# EAGLE design sensorfly_boardonly (EAGLE 5.11)

## Sheet 1 of 3
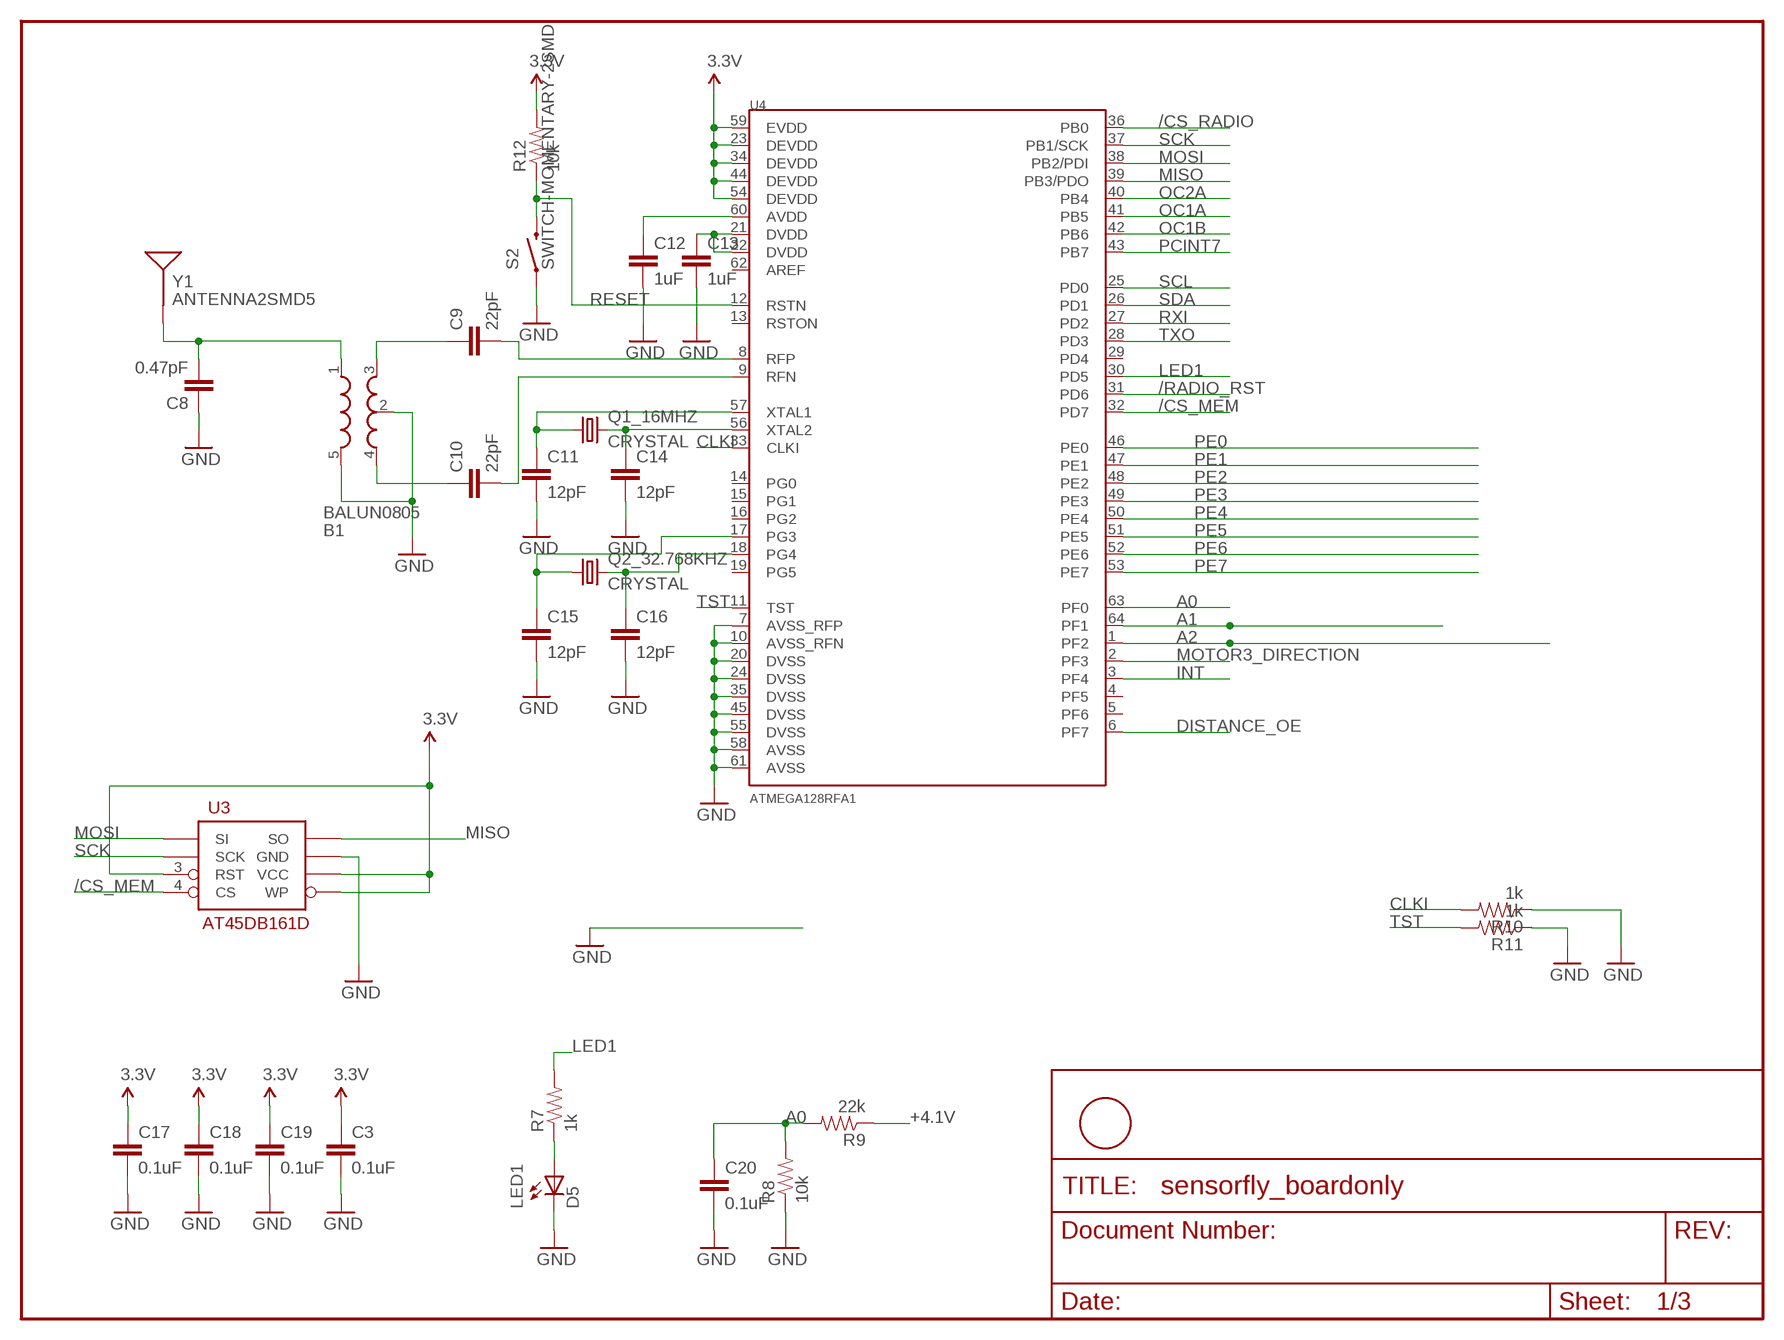
[diagram p0: schematic, sheet 1]

### Parts
B1  BALUN0805  [BALUN]
C3  0.1uF  CAP0402-CAP  [0402-CAP]
C8  0.47pF  CAP0402-CAP  [0402-CAP]
C9  22pF  CAP0402-CAP  [0402-CAP]
C10  22pF  CAP0402-CAP  [0402-CAP]
C11  12pF  CAP0402-CAP  [0402-CAP]
C12  1uF  CAP0805  [0805]
C13  1uF  CAP0805  [0805]
C14  12pF  CAP0402-CAP  [0402-CAP]
C15  12pF  CAP0402-CAP  [0402-CAP]
C16  12pF  CAP0402-CAP  [0402-CAP]
C17  0.1uF  CAP0402-CAP  [0402-CAP]
C18  0.1uF  CAP0402-CAP  [0402-CAP]
C19  0.1uF  CAP0402-CAP  [0402-CAP]
C20  0.1uF  CAP0402-CAP  [0402-CAP]
D5  LED1  LED0603  [LED-0603]
Q1_16MHZ  CRYSTAL  [TC26V]
Q2_32.768KHZ  CRYSTAL  [TC26V]
R7  1k  RESISTOR0402-RES  [0402-RES]
R8  10k  RESISTOR0402-RES  [0402-RES]
R9  22k  RESISTOR0402-RES  [0402-RES]
R10  1k  RESISTOR0402-RES  [0402-RES]
R11  1k  RESISTOR0402-RES  [0402-RES]
R12  10k  RESISTOR0402-RES  [0402-RES]
S2  SWITCH-MOMENTARY-2SMD  [TACTILE_SWITCH_SMD]
U3  AT45DB161D  [SO08-EIAJ]
U4  ATMEGA128RFA1  [QFN-64]
U$1  SENSORFLUSMALLER  [SENSORFLY_SMALLER]
Y1  ANTENNA2SMD5  [ANTENNA-CHIP5]

### Nets
3.3V: C3.1 C17.1 C18.1 C19.1 R12.2 U3.3(RST) U3.5(WP) U3.6(VCC) U4.23(DEVDD) U4.34(DEVDD) U4.44(DEVDD) U4.54(DEVDD) U4.59(EVDD) ; also sheet 2,3
+4.1V: R9.1 ; also sheet 2,3
/CS_MEM: U3.4(CS) U4.32(PD7)
/CS_RADIO: U4.36(PB0) ; also sheet 2
/RADIO_RST: U4.31(PD6) ; also sheet 2
A0: C20.1 R8.2 R9.2 U4.63(PF0) ; also sheet 2
A1: U4.64(PF1) ; also sheet 2
A2: U4.1(PF2) ; also sheet 2
CLKI: R10.2 U4.33(CLKI)
DISTANCE_OE: U4.6(PF7) ; also sheet 2
GND: B1.2(GND) B1.5(GND) C3.2 C8.1 C11.2 C12.2 C13.2 C14.2 C15.2 C16.2 C17.2 C18.2 C19.2 C20.2 D5.C R8.1 R10.1 R11.1 S2.1 U3.7(GND) U4.7(AVSS_RFP) U4.10(AVSS_RFN) U4.20(DVSS) U4.24(DVSS) U4.35(DVSS) U4.45(DVSS) U4.55(DVSS) U4.58(AVSS) U4.61(AVSS) ; also sheet 2,3
INT: U4.3(PF4) ; also sheet 2
LED1: R7.2 U4.30(PD5)
MISO: U3.8(SO) U4.39(PB3/PDO) ; also sheet 2
MOSI: U3.1(SI) U4.38(PB2/PDI) ; also sheet 2
MOTOR3_DIRECTION: U4.2(PF3) ; also sheet 3
N$66: B1.3(OUT1) C9.1
N$68: B1.4(OUT2) C10.1
N$70: B1.1(IN) C8.2 Y1.FEED(SIGNAL)
N$71: C10.2 U4.9(RFN)
N$72: C9.2 U4.8(RFP)
N$75: C12.1 U4.60(AVDD)
N$76: C11.1 Q1_16MHZ.1 U4.57(XTAL1)
N$77: C14.1 Q1_16MHZ.2 U4.56(XTAL2)
N$78: C15.1 Q2_32.768KHZ.1 U4.17(PG3)
N$79: C16.1 Q2_32.768KHZ.2 U4.18(PG4)
N$98: C13.1 U4.21(DVDD) U4.22(DVDD)
N$99: D5.A R7.1
OC1A: U4.41(PB5) ; also sheet 3
OC1B: U4.42(PB6) ; also sheet 3
OC2A: U4.40(PB4) ; also sheet 3
PCINT7: U4.43(PB7) ; also sheet 2
PE0: U4.46(PE0) ; also sheet 2
PE1: U4.47(PE1) ; also sheet 2
PE2: U4.48(PE2) ; also sheet 2
PE3: U4.49(PE3) ; also sheet 2
PE4: U4.50(PE4) ; also sheet 2
PE5: U4.51(PE5) ; also sheet 2
PE6: U4.52(PE6) ; also sheet 2
PE7: U4.53(PE7) ; also sheet 2
RESET: R12.1 S2.3 U4.12(RSTN) ; also sheet 2
RXI: U4.27(PD2) ; also sheet 2
SCK: U3.2(SCK) U4.37(PB1/SCK) ; also sheet 2
SCL: U4.25(PD0) ; also sheet 2
SDA: U4.26(PD1) ; also sheet 2
TST: R11.2 U4.11(TST)
TXO: U4.28(PD3) ; also sheet 2
Unconnected: U4.4(PF5) U4.5(PF6) U4.13(RSTON) U4.14(PG0) U4.15(PG1) U4.16(PG2) U4.19(PG5) U4.29(PD4) U4.62(AREF)

## Sheet 2 of 3
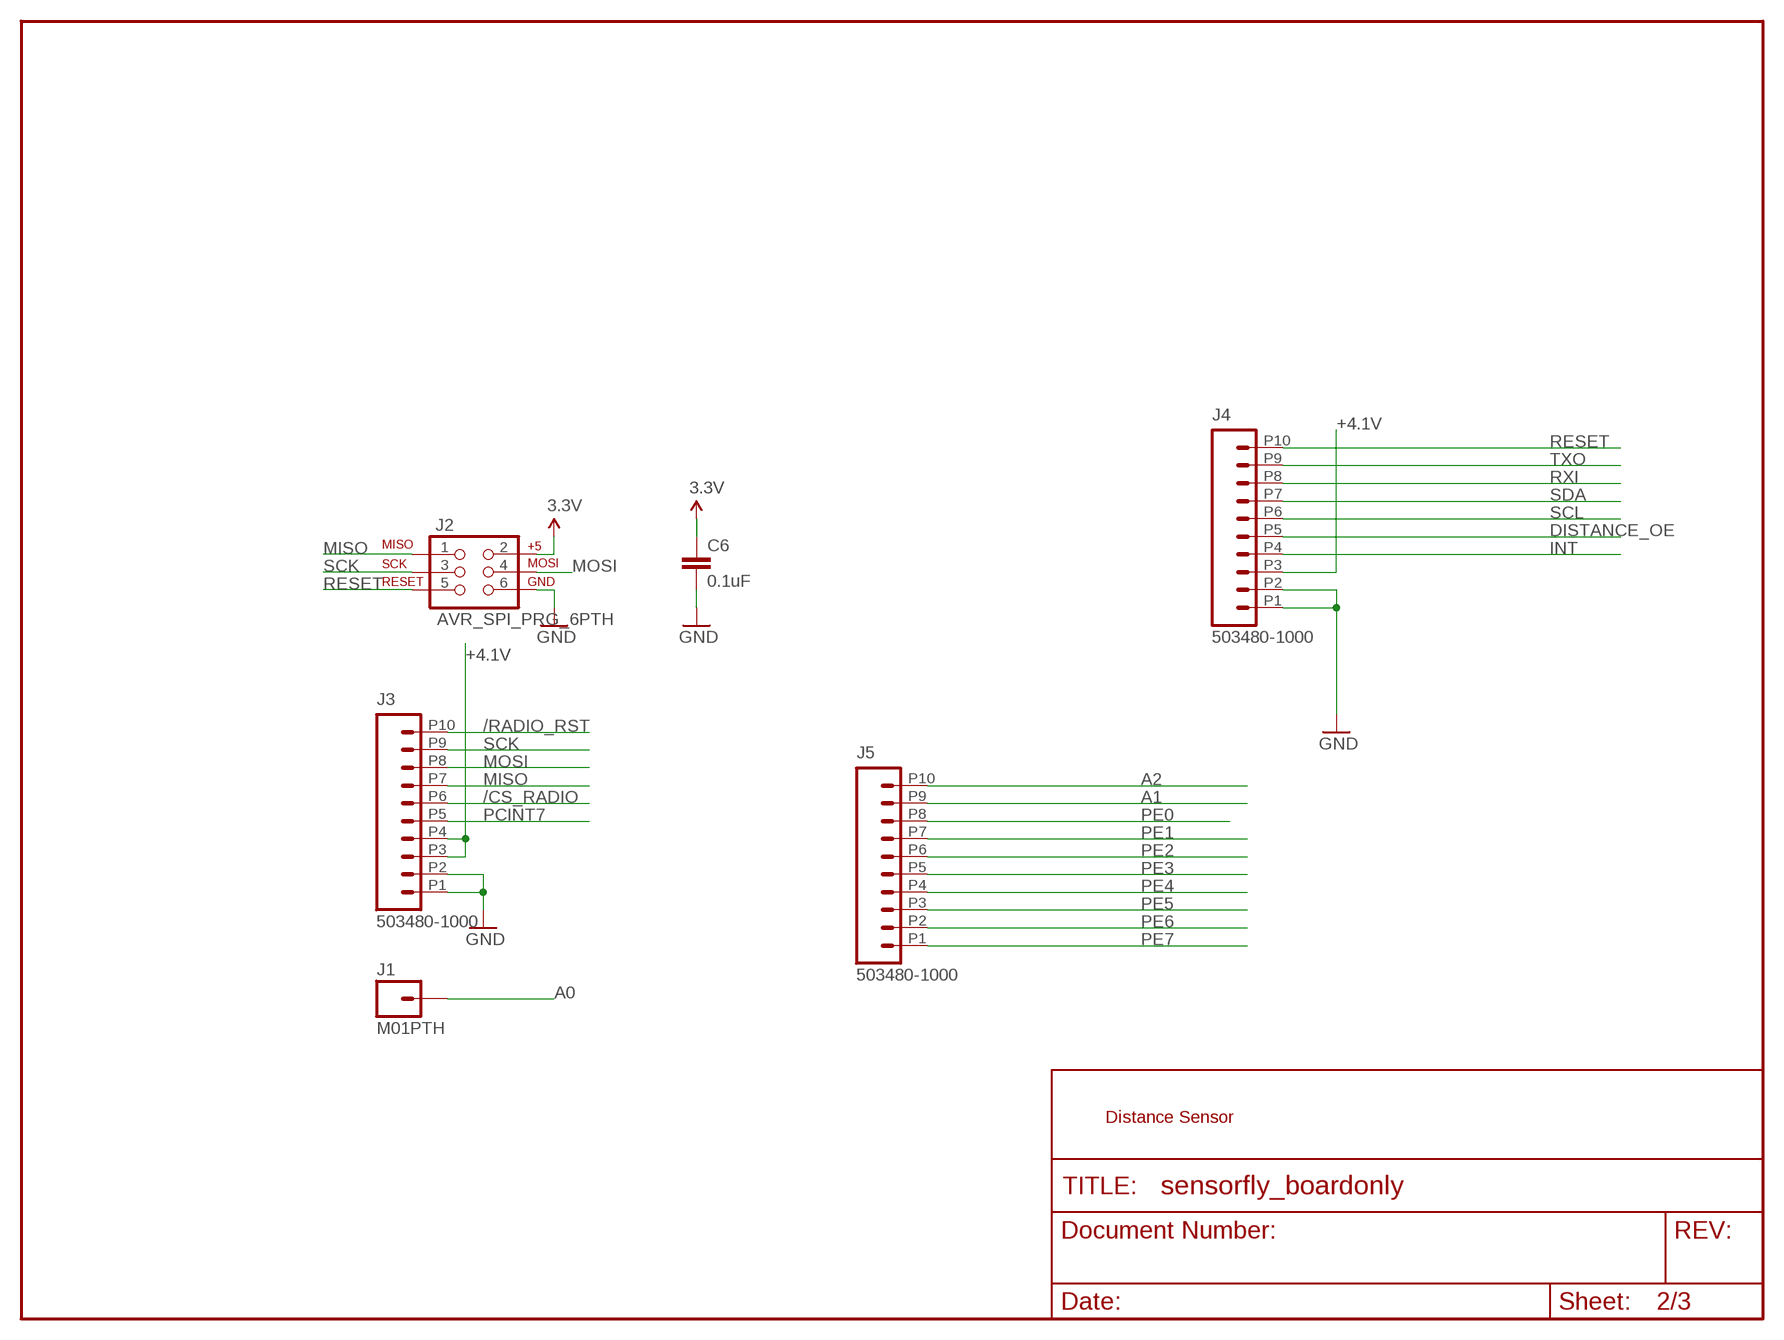
[diagram p1: schematic, sheet 2]

### Parts
C6  0.1uF  CAP0402-CAP  [0402-CAP]
J1  M01PTH  [1X01]
J2  AVR_SPI_PRG_6PTH  [2X3]
J3  503480-1000  [503480-1000]
J4  503480-1000  [503480-1000]
J5  503480-1000  [503480-1000]

### Nets
3.3V: C6.1 J2.2 ; also sheet 1,3
+4.1V: J3.P3 J3.P4 J4.P3 ; also sheet 1,3
/CS_RADIO: J3.P6 ; also sheet 1
/RADIO_RST: J3.P10 ; also sheet 1
A0: J1.1 ; also sheet 1
A1: J5.P9 ; also sheet 1
A2: J5.P10 ; also sheet 1
DISTANCE_OE: J4.P5 ; also sheet 1
GND: C6.2 J2.6 J3.P1 J3.P2 J4.P1 J4.P2 ; also sheet 1,3
INT: J4.P4 ; also sheet 1
MISO: J2.1 J3.P7 ; also sheet 1
MOSI: J2.4 J3.P8 ; also sheet 1
PCINT7: J3.P5 ; also sheet 1
PE0: J5.P8 ; also sheet 1
PE1: J5.P7 ; also sheet 1
PE2: J5.P6 ; also sheet 1
PE3: J5.P5 ; also sheet 1
PE4: J5.P4 ; also sheet 1
PE5: J5.P3 ; also sheet 1
PE6: J5.P2 ; also sheet 1
PE7: J5.P1 ; also sheet 1
RESET: J2.5 J4.P10 ; also sheet 1
RXI: J4.P8 ; also sheet 1
SCK: J2.3 J3.P9 ; also sheet 1
SCL: J4.P6 ; also sheet 1
SDA: J4.P7 ; also sheet 1
TXO: J4.P9 ; also sheet 1

### Notes on the sheet
- Distance Sensor

## Sheet 3 of 3
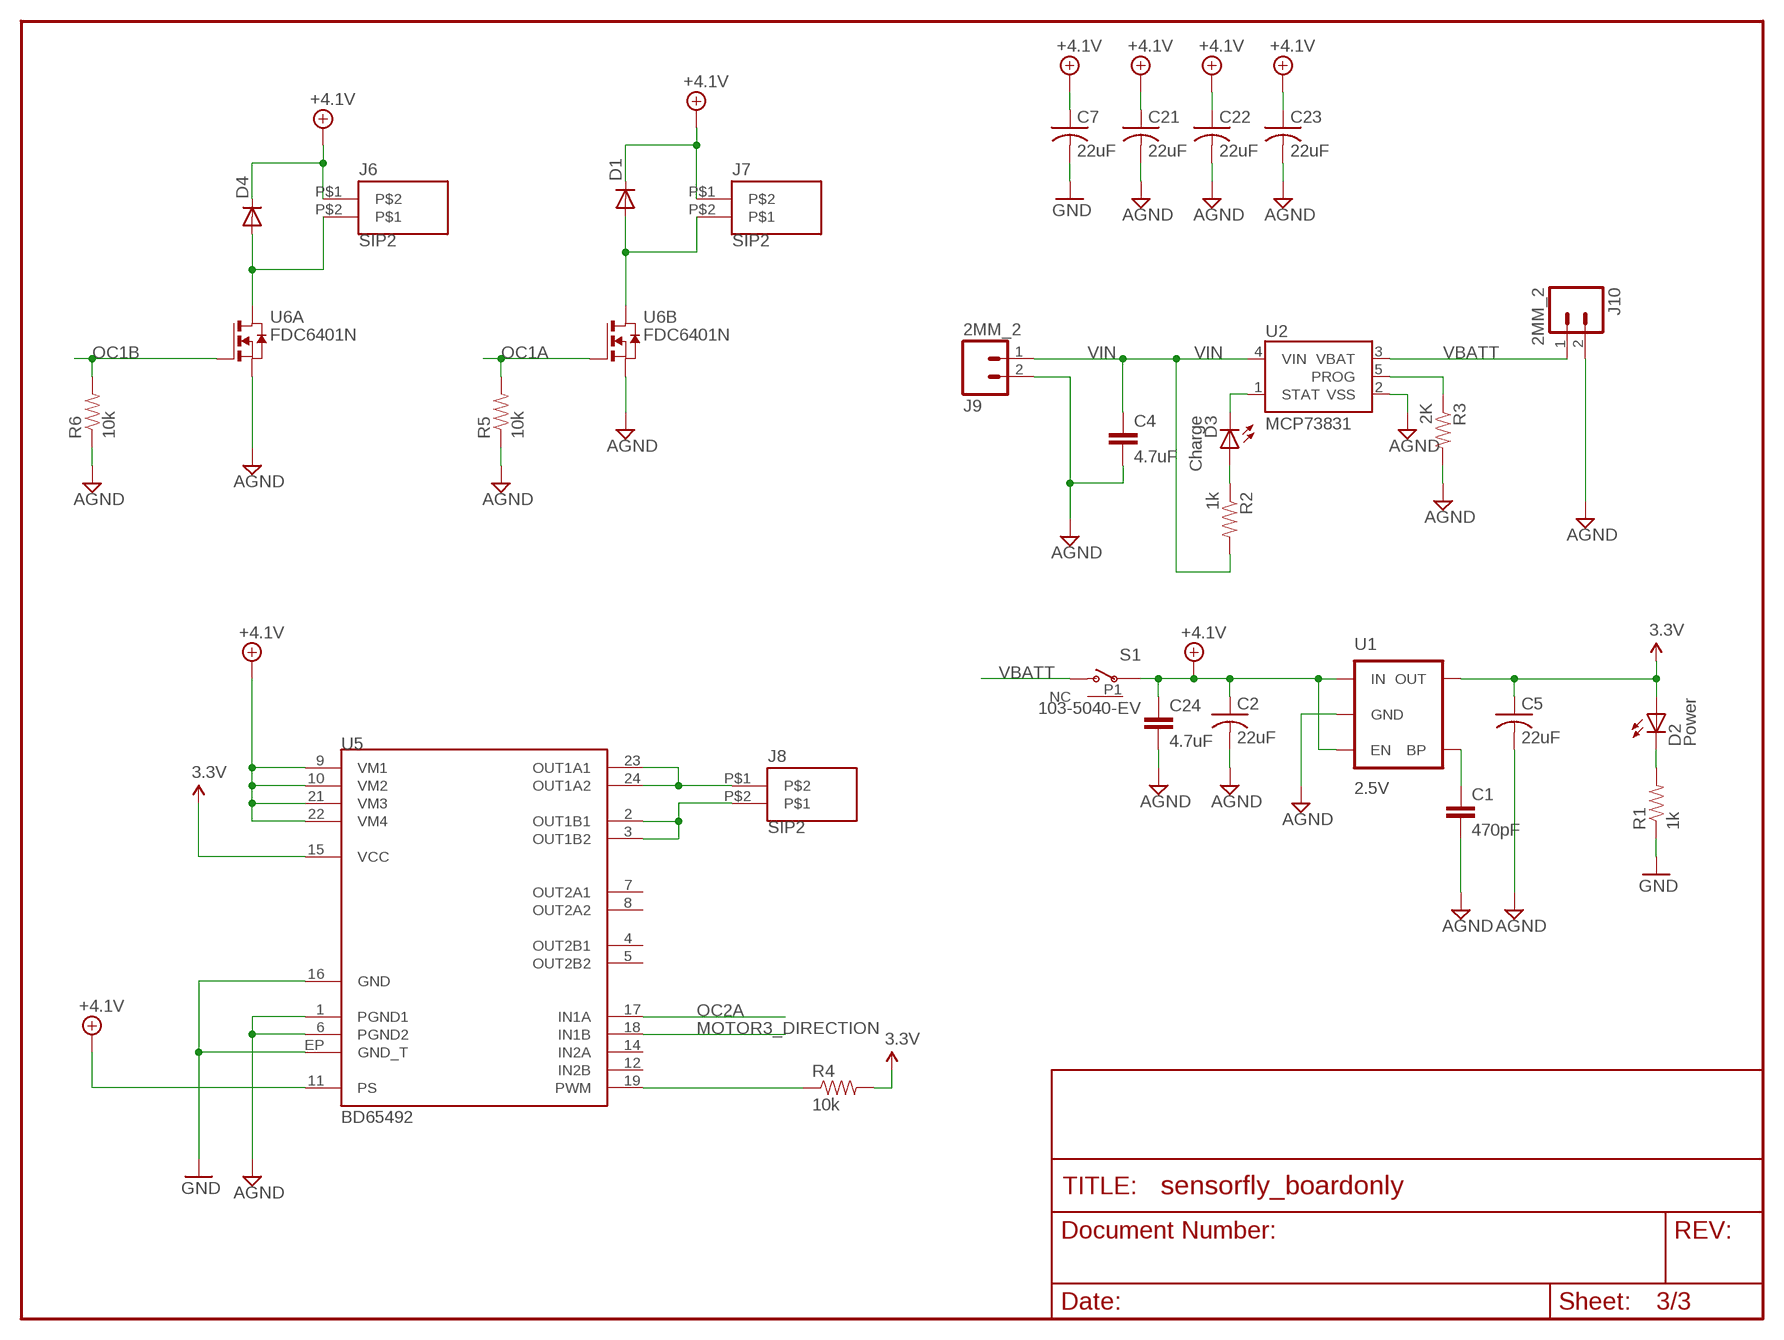
[diagram p2: schematic, sheet 3]

### Parts
C1  470pF  CAP0402-CAP  [0402-CAP]
C2  22uF  C-USC0805  [C0805]
C4  4.7uF  CAP0805  [0805]
C5  22uF  C-USC0805  [C0805]
C7  22uF  C-USC0805  [C0805]
C21  22uF  C-USC0805  [C0805]
C22  22uF  C-USC0805  [C0805]
C23  22uF  C-USC0805  [C0805]
C24  4.7uF  CAP0805  [0805]
D1  DIODESOD  [SOD-323]
D2  Power  LED0603  [LED-0603]
D3  Charge  LED0603  [LED-0603]
D4  DIODESOD  [SOD-323]
J6  SIP2  [SIP2.05]
J7  SIP2  [SIP2.05]
J8  SIP2  [SIP2.05]
J9  2MM_2  [PH02]
J10  2MM_2  [PH02]
R1  1k  RESISTOR0402-RES  [0402-RES]
R2  1k  RESISTOR0402-RES  [0402-RES]
R3  2K  RESISTOR0402-RES  [0402-RES]
R4  10k  RESISTOR0402-RES  [0402-RES]
R5  10k  RESISTOR0402-RES  [0402-RES]
R6  10k  RESISTOR0402-RES  [0402-RES]
S1  103-5040-EV  [103-5040-EV]
U1  2.5V  V_REG_LDOSMD  [SOT23-5]
U2  MCP73831  [SOT23-5]
U5  BD65492  [QFN-24]
U6  FDC6401N  [SUPERSOT-6]

### Nets
3.3V: C5.1 D2.A R4.2 U1.5(OUT) U5.15(VCC) ; also sheet 1,2
+4.1V: C2.1 C7.1 C21.1 C22.1 C23.1 C24.1 D1.1(C) D4.1(C) J6.P$1 J7.P$1 S1.P3(P) U1.1(IN) U1.3(EN) U5.9(VM1) U5.10(VM2) U5.11(PS) U5.21(VM3) U5.22(VM4) ; also sheet 1,2
AGND: C1.2 C2.2 C4.2 C5.2 C21.2 C22.2 C23.2 C24.2 J9.2 J10.2 R3.2 R5.1 R6.1 U1.2(GND) U2.2(VSS) U5.1(PGND1) U5.6(PGND2) U6.P$2(B:S) U6.P$5(A:S)
GND: C7.2 R1.1 U5.16(GND) U5.EP(GND_T) ; also sheet 1,2
MOTOR3_DIRECTION: U5.18(IN1B) ; also sheet 1
N$1: D2.C R1.2
N$2: C1.1 U1.4(BP)
N$3: D3.A R2.1
N$67: D1.2(A) J7.P$2 U6.P$4(B:D)
N$69: D4.2(A) J6.P$2 U6.P$6(A:D)
N$114: J8.P$1 U5.23(OUT1A1) U5.24(OUT1A2)
N$115: J8.P$2 U5.2(OUT1B1) U5.3(OUT1B2)
N$120: R4.1 U5.19(PWM)
OC1A: R5.2 U6.P$3(B:G) ; also sheet 1
OC1B: R6.2 U6.P$1(A:G) ; also sheet 1
OC2A: U5.17(IN1A) ; also sheet 1
PROG1: R3.1 U2.5(PROG)
STAT1: D3.C U2.1(STAT)
VBATT: J10.1 S1.P2(O) U2.3(VBAT)
VIN: C4.1 J9.1 R2.2 U2.4(VIN)
Unconnected: S1.P1(NC) U5.4(OUT2B1) U5.5(OUT2B2) U5.7(OUT2A1) U5.8(OUT2A2) U5.12(IN2B) U5.14(IN2A)

## Library data of the parts
B1 = SparkFun:BALUN
C1 C3 C4 C6 C8-C20 C24 = SparkFun:CAP: Capacitor Standard 0603 ceramic capacitor, and 0.1" leaded capacitor.
C2 C5 C7 C21-C23 = rcl:C-US: CAPACITOR, American symbol
D1 D4 = SparkFun:DIODE: Diode These are standard reverse protection diodes and small signal diodes. SMA package can handle up to about 1A. SOD-323 can handle about 200mA. What the SOD-323 package when ordering, there are some mfgs out there that are 5-pin packages.
D2 D3 D5 = SparkFun:LED: LEDs Standard schematic elements and footprints for 5mm, 3mm, 1206, and 0603 sized LEDs. 5mm - Spark Fun Electronics SKU : COM-00529 (and others)
J1 = SparkFun:M01: Header 1 Standard 1-pin 0.1" header. Use with straight break away headers (SKU : PRT-00116), right angle break away headers (PRT-00553), swiss pins (PRT-00743), machine pins (PRT-00117), and female headers (PRT-00115).
J2 = SparkFun:AVR_SPI_PRG_6: AVR ISP 6 Pin This is the reduced ISP connector for AVR programming. Common on Arduino. This footprint will take up less PCB space and can be used with a 10-pin to 6-pin adapter such as SKU: BOB-08508
J3-J5 = pei:503480-1000
J6-J8 = my:SIP2
J9 J10 = SparkFun:2MM_2
Q1_16MHZ Q2_32.768KHZ = pei:CRYSTAL
R1-R12 = SparkFun:RESISTOR: Resistor Basic schematic elements and footprints for 0603, 1206, and PTH resistors.
S1 = pei:103-5040-EV
S2 = SparkFun:SWITCH-MOMENTARY-2
U1 = SparkFun:V_REG_LDO: Voltage Regulator LDO Standard 150mA LDO voltage regulator in SOT-23 layout. Micrel part MIC5205. BP (by-pass) pin is used to lower output noise with 470pF cap.
U2 = SparkFun:MCP73831: Microchip's MCP73831 Miniature single cell, fully integrated Li-Ion, Li-polymer charge management controller http://ww1.microchip.com/downloads/en/DeviceDoc/21984a.pdf
U3 = SparkFun:AT45DB161D
U4 = SparkFun:ATMEGA128RFA1
U5 = pei:BD65492
U6 = pei:FDC6401N
U$1 = my:SENSORFLU
Y1 = SparkFun:ANTENNA2: Antenna Single endded antenna. Common with smaller chip antennas. CHIP4 package is the GPS Chip Antenna SKU: GPS-08418. CHIP5 package is 2.4GHz chip antenna SKU: WRL-00144.

## Net classes
0 default: width 0.152 mm, drill 0.152 mm, clearance 0.152 mm
1 power: width 0.254 mm, drill 0.305 mm, clearance 0.152 mm

## Board
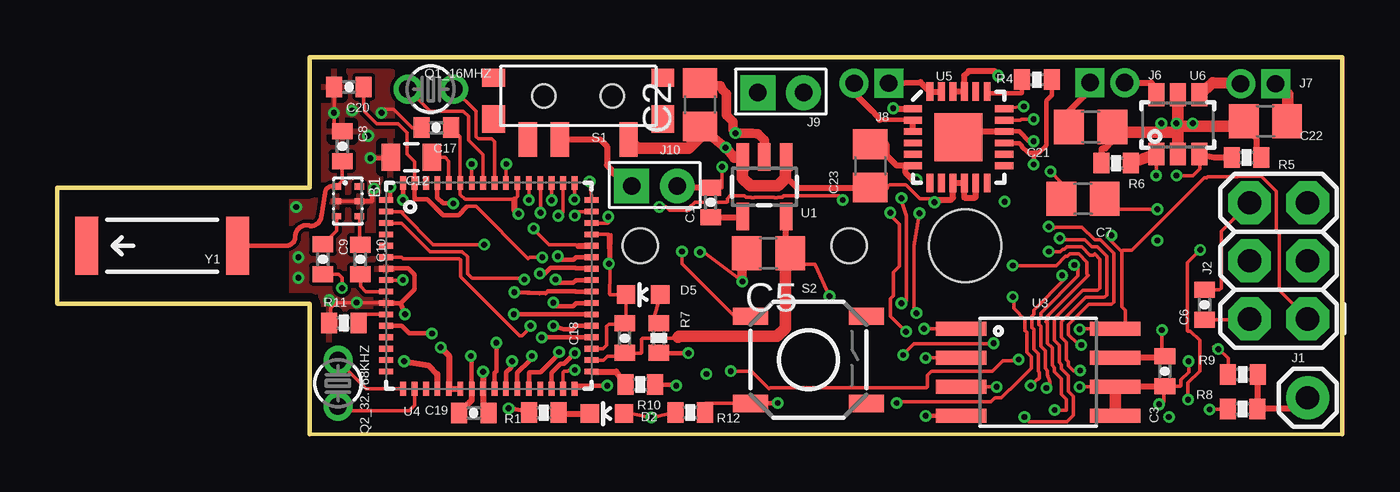
[diagram p3: board, top side]
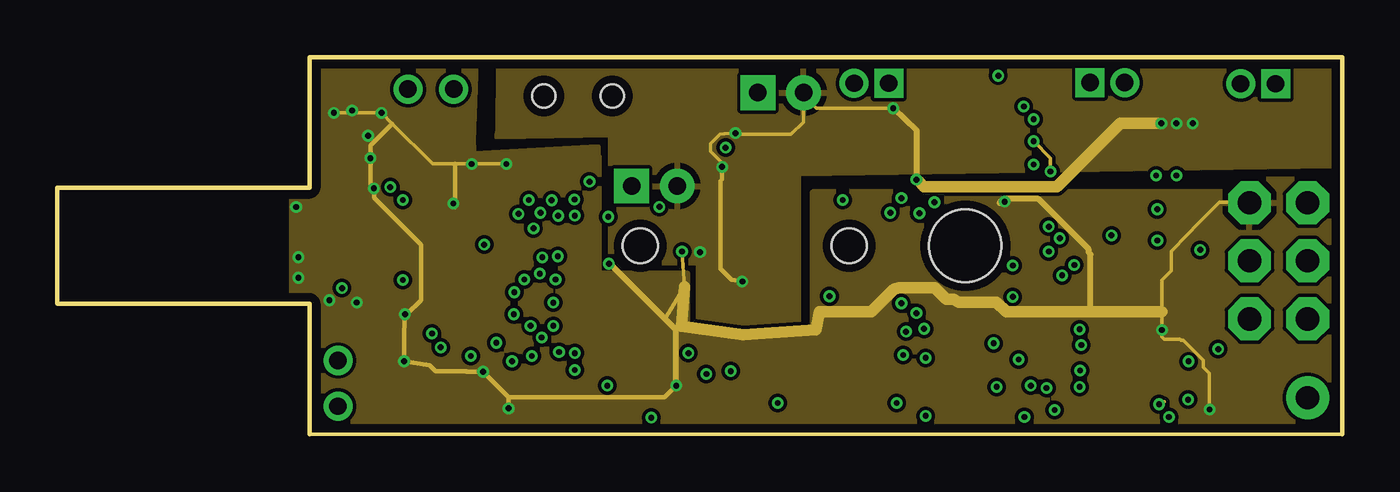
[diagram p4: board, inner layer Route2]
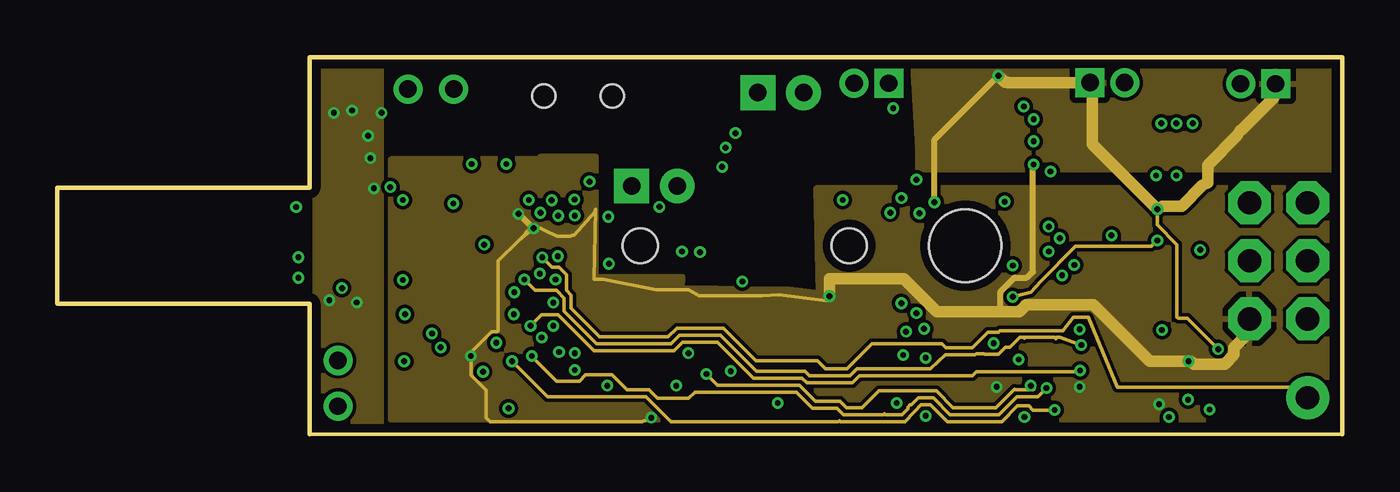
[diagram p5: board, inner layer Route15]
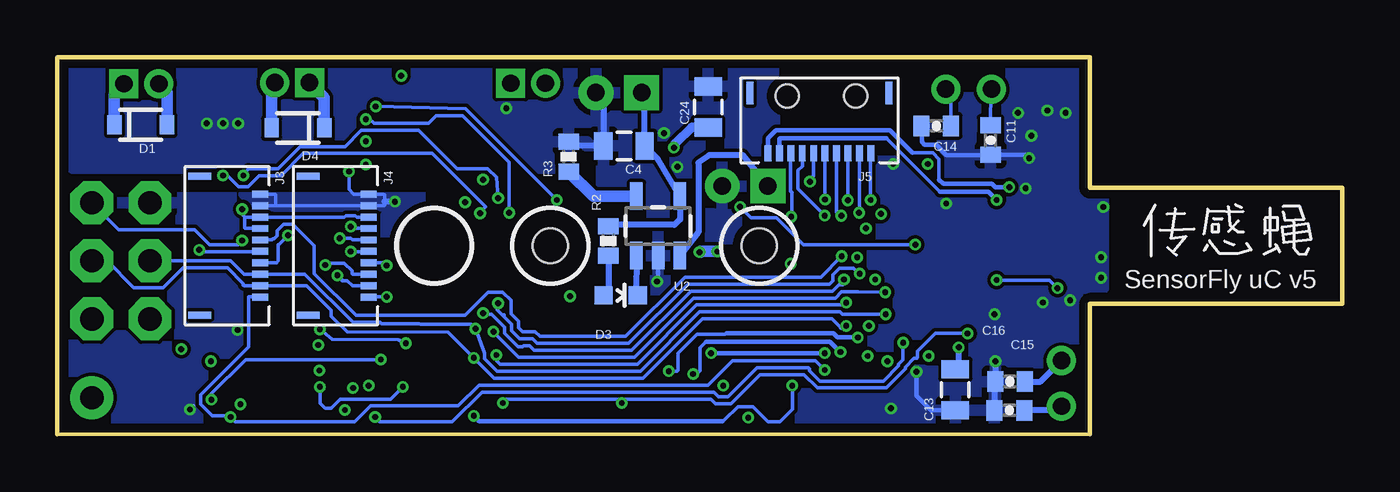
[diagram p6: board, bottom side, seen from below]

Size 56.26 x 16.51 mm. Coordinates in mm from the lower left corner, seen from the top.
Outline: 11.05,16.51 11.05,10.8 0,10.8 0,5.71 11.05,5.71 11.05,0 56.26,0 56.26,16.51 11.05,16.51
Copper layers (1*2+15*16): Top 0.0356mm / dielectric 1.5011mm / Route2 0.0356mm / dielectric 0.1499mm / Route15 0.0356mm / dielectric 0.2007mm / Bottom 0.0356mm
Design rules "typical_4pcb *": minimum track width 5mil, minimum drill 6mil, track to track 6mil, track to pad 6mil, pad to pad 7mil, via to via 7mil, smd to smd 6mil, copper to edge 15mil, drill to drill 8mil, minimum pad ring 10mil, minimum via ring 5mil, stop-mask expansion 4mil, vias tented up to drill 10mil, thermal gap 10mil
Holes 1.52 mm at 25.53,8.25 34.67,8.25
Holes 3.17 mm at 39.75,8.25

### Footprints (pad centres in the part's own frame; a part is rotated, then mirrored left to right if it is on the bottom)
BALUN = smd 0.27 x 0.4: 1 -0.7,-0.5; 2 -0.05,-0.5; 3 0.6,-0.5; 4 0.6,0.5; 5 -0.05,0.5; 6 -0.7,0.5
0402-CAP = smd 0.7 x 0.9: 1 -0.65,0; 2 0.65,0
C0805 = smd 1.3 x 1.5: 1 -0.95,0; 2 0.95,0
0805 = smd 0.8 x 1.2: 1 -0.9,0; 2 0.9,0
SOD-323 = smd 0.63 x 0.83: 1 -1.15,0; 2 1.15,0
LED-0603 = smd 0.8 x 0.8: A 0,-0.75; C 0,0.75
1X01 = drill 1.016 pad 1.88 round: 1 0,0
2X3 = drill 1.016 pad 1.88 octagon: 1 0,0; 2 0,2.54; 3 2.54,0; 4 2.54,2.54; 5 5.08,0; 6 5.08,2.54
503480-1000 = smd 0.3 x 0.7: P1 -2,0; P2 -1.5,0; P3 -1,0; P4 -0.5,0; P5 0,0; P6 0.5,0; P7 1,0; P8 1.5,0; P9 2,0; P10 2.5,0 | smd 0.3 x 1: P$11 -2.79,-2.65; P$12 3.29,-2.65
SIP2.05 = drill 0.762 pad 1.016 square: P$1 0,0 | drill 0.762 pad 1.016 round: P$2 1.524,0
PH02 = drill 0.762 pad 1.524 square: 1 -1,2 | drill 0.762 pad 1.524 round: 2 1,2
TC26V = drill 0.762 pad 1.118 round: 1 -1,0; 2 1,0
0402-RES = smd 0.7 x 0.9: 1 -0.65,0; 2 0.65,0
103-5040-EV = smd 1 x 1.2: CASE1 -3.7,1; CASE5 3.7,1 | smd 1 x 0.8: CASE2 -3.7,-0.8; CASE6 3.7,-0.8 | smd 0.8 x 1.5: P1 2.2,1.9; P2 0.8,1.9; P3 -2.2,1.9 | hole 1.016: -1.5,0; 1.5,0
TACTILE_SWITCH_SMD = smd 1.524 x 0.762: 1 -2.54,1.905; 2 2.54,1.905; 3 -2.54,-1.905; 4 2.54,-1.905
SOT23-5 = smd 0.55 x 1.2: 1 -0.95,-1.3; 2 0,-1.3; 3 0.95,-1.3; 4 0.95,1.3; 5 -0.95,1.3
SO08-EIAJ = smd 0.61 x 2.21: 1 -1.905,-3.378; 2 -0.635,-3.378; 3 0.635,-3.378; 4 1.905,-3.378; 5 1.905,3.353; 6 0.635,3.353; 7 -0.635,3.353; 8 -1.905,3.353
QFN-64 = smd 0.6 x 0.25: 1 -4.5,3.75; 2 -4.5,3.25; 3 -4.5,2.75; 4 -4.5,2.25; 5 -4.5,1.75; 6 -4.5,1.25; 7 -4.5,0.75; 8 -4.5,0.25; 9 -4.5,-0.25; 10 -4.5,-0.75; 11 -4.5,-1.25; 12 -4.5,-1.75; 13 -4.5,-2.25; 14 -4.5,-2.75; 15 -4.5,-3.25; 16 -4.5,-3.75; 33 4.5,-3.75; 34 4.5,-3.25; 35 4.5,-2.75; 36 4.5,-2.25; 37 4.5,-1.75; 38 4.5,-1.25; 39 4.5,-0.75; 40 4.5,-0.25; 41 4.5,0.25; 42 4.5,0.75; 43 4.5,1.25; 44 4.5,1.75; 45 4.5,2.25; 46 4.5,2.75; 47 4.5,3.25; 48 4.5,3.75 | smd 0.25 x 0.6: 17 -3.75,-4.5; 18 -3.25,-4.5; 19 -2.75,-4.5; 20 -2.25,-4.5; 21 -1.75,-4.5; 22 -1.25,-4.5; 23 -0.75,-4.5; 24 -0.25,-4.5; 25 0.25,-4.5; 26 0.75,-4.5; 27 1.25,-4.5; 28 1.75,-4.5; 29 2.25,-4.5; 30 2.75,-4.5; 31 3.25,-4.5; 32 3.75,-4.5; 49 3.75,4.5; 50 3.25,4.5; 51 2.75,4.5; 52 2.25,4.5; 53 1.75,4.5; 54 1.25,4.5; 55 0.75,4.5; 56 0.25,4.5; 57 -0.25,4.5; 58 -0.75,4.5; 59 -1.25,4.5; 60 -1.75,4.5; 61 -2.25,4.5; 62 -2.75,4.5; 63 -3.25,4.5; 64 -3.75,4.5
QFN-24 = smd 0.8 x 0.3: 1 -1.986,1.248; 2 -1.986,0.748; 3 -1.986,0.248; 4 -1.986,-0.252; 5 -1.986,-0.752; 6 -1.986,-1.252; 13 2.014,-1.252; 14 2.014,-0.752; 15 2.014,-0.252; 16 2.014,0.248; 17 2.014,0.748; 18 2.014,1.248 | smd 0.3 x 0.8: 7 -1.236,-2.002; 8 -0.736,-2.002; 9 -0.236,-2.002; 10 0.264,-2.002; 11 0.764,-2.002; 12 1.264,-2.002; 19 1.264,1.998; 20 0.764,1.998; 21 0.264,1.998; 22 -0.236,1.998; 23 -0.736,1.998; 24 -1.236,1.998 | smd 2.1 x 2.1: EP 0,0
SUPERSOT-6 = smd 0.7 x 1: P$1 -0.95,0; P$2 0,0; P$3 0.95,0; P$4 0.95,2.6; P$5 0,2.6; P$6 -0.95,2.6
ANTENNA-CHIP5 = smd 1.016 x 2.54: FEED -3.302,0; NC 3.302,0

### Placement (x,y rotation side)
B1  12.73,10.15 270 top
C1  28.6,10.15 90 top
C2  28.14,14.43 90 top
C3  48.49,2.77 90 top
C4  31.45,12.63 180 bottom
C5  31.14,7.92 180 top
C6  50.23,5.68 90 top
C7  44.91,10.31 180 top
C8  12.48,12.61 270 top
C9  11.63,7.67 270 top
C10  13.28,7.66 270 top
C11  15.4,12.88 270 bottom
C12  15.51,12.13 180 top
C13  16.94,1.96 270 bottom
C14  17.78,13.5 180 bottom
C15  14.55,2.31 180 bottom
C16  14.58,1.06 180 bottom
C17  16.6,13.42 180 top
C18  24.84,4.22 90 top
C19  18.24,0.94 0 top
C20  12.78,15.21 180 top
C21  45.24,13.45 0 top
C22  52.89,13.71 180 top
C23  35.59,11.75 90 top
C24  27.76,14.33 90 bottom
D1  52.6,13.55 0 bottom
D2  24.06,0.91 90 top
D3  31.59,6.09 270 bottom
D4  45.72,13.41 180 bottom
D5  25.65,6.12 90 top
J1  54.74,1.6 0 top
J2  54.74,5.05 90 top
J3  47.37,8.51 270 bottom
J4  42.62,8.51 270 bottom
J5  22.64,12.29 180 bottom
J6  45.21,15.39 0 top
J7  53.34,15.35 180 top
J8  36.41,15.37 180 top
J9  31.68,12.95 0 top
J10  26.15,8.87 0 top
Q1_16MHZ  16.36,15.11 0 top
Q2_32.768KHZ  12.29,2.24 270 top
R1  21.31,0.95 0 top
R2  32.13,8.47 90 bottom
R3  33.87,12.15 90 bottom
R4  42.89,15.52 0 top
R5  52.06,12.12 180 top
R6  46.36,11.87 0 top
R7  26.34,4.22 270 top
R8  51.89,1.11 0 top
R9  51.9,2.62 0 top
R10  25.53,2.18 180 top
R11  12.55,4.88 0 top
R12  27.71,0.95 180 top
S1  22.81,14.81 180 top
S2  32.89,3.27 0 top
U1  30.96,10.84 180 top
U2  29.95,9.13 0 bottom
U3  42.96,2.73 270 top
U4  18.9,6.5 0 top
U5  39.45,13 0 top
U6  49.06,12.27 0 top
U$1  4.93,8.99 0 bottom
Y1  4.6,8.25 180 top

### Tracks (layer width: path | path; a pad name or v marks a point on that pad's centre or on a via)
3.3V  (via drill 0.25 pad 0.51)
  Top 0.152: C17.1 17.65,13.03 U4.59 17.65,10.5 17.86,10.29 20.01,10.29 20.15,10.42 U4.54 | U4.34 23.93,3.25 24.1,3.43 24.7,3.43 C18.1 24.89,3.56 25.55,3.56 25.58,3.58 25.58,4.17 25.63,4.22 27.05,4.22 27.08,4.24 27.18,4.24 | R12.2 27.05,0.96 v26.01,0.74 24.87,0.96 D2.A | 32.11,7.44 33.17,7.44 v33.81,6.05 | U3.3 39.6,2.08 v41.12,2.08 | U3.6 46.08,2.08 v44.76,2.08 | v20.85,9.02 20.9,8.94 21.54,8.31 22.71,8.31 22.81,8.25 | v48.23,1.32 48.34,1.32 48.44,1.42 48.44,1.98 C3.1 48.59,2.11 49.17,2.11 49.2,2.13 49.2,2.39 49.53,2.72 v49.53,3.2 | J2.2 52.17,5.03 50.24,5.03 C6.1
  Top 0.203: U4.23 18.14,2.11 18.14,3.43 v18.11,3.43 | 42.75,12.32 42.52,12.32 42.24,12.6 42.24,12.62 42.11,12.75 41.48,12.75 U5.15 | 42.75,12.32 42.98,12.32 43.26,12.6 43.31,12.68 43.31,14.61 43.54,14.83 R4.2 | v42.75,11.81 42.75,12.32
  Top 0.254: U4.23 18.15,1.5 C19.1 | 31.91,7.69 31.91,7.87 U1.5 | U3.6 48.46,2.09 C3.1 | 22.81,8.25 U4.44 | 20.01,10.29 20.01,9.83 v20.19,9.65
  Top 0.406: 31.91,7.87 C5.1 31.88,7.54 | 32.11,7.44 31.88,7.47
  Top 0.508: U3.6 U3.5 | 31.88,7.54 31.88,7.47 31.88,4.65 31.52,4.29 27.23,4.29 27.18,4.24
  Route2 0.152: 48.46,1.42 48.34,1.42 v48.23,1.32
  Route15 0.152: v26.01,0.74 25.6,0.56 18.95,0.56 18.77,0.74 18.77,1.93 18.11,2.59 v18.11,3.43 18.16,3.48 18.16,3.63 19.02,4.5 19.25,4.5 19.3,4.55 19.3,7.59 20.19,8.48 | 20.19,8.48 20.5,8.79 20.52,8.84 20.76,9.08 | v33.81,6.05 33.68,5.84 31.6,6.12 30.86,6.07 28.09,6.07 27.63,6.32 26.21,6.32 23.9,6.78 23.49,6.78 23.57,9.86 23.55,9.75 22.63,8.71 22.53,8.71 22.48,8.66 21.89,8.66 20.88,9.14 v20.85,9.02 20.19,8.48
  Route15 0.254: 20.76,9.08 v20.19,9.65 | v42.75,11.81 42.72,11.79 42.72,7.11 42.62,7.04 42.44,6.86 41.91,6.86 41.3,6.25 41.3,5.36
  Route15 0.508: J2.2 52.2,4.47 51.51,3.79 51.51,3.48 51.11,3.07 49.76,3.07 49.63,3.2 v49.53,3.2 47.83,3.2 45.36,5.66 42.42,5.66 42.11,5.36 41.3,5.36 38.51,5.36 37.06,6.81 33.81,6.81 v33.81,6.05
  Bottom 0.152: 41.02,2.08 v41.12,2.08 41.66,1.55 43.87,1.55 44.27,1.14 44.5,1.14 44.55,1.17 44.76,1.37 v44.76,2.08 44.88,2.08 | v49.53,3.2 49.58,3.25
  pour Route15: 21.13,12.04 14.61,12.04 14.61,0.66 55.58,0.66 55.58,10.77 33.22,10.77 33.32,6.17 32.05,6.32 27.36,6.4 27.38,6.88 23.6,6.88 23.6,12.14 21.13,12.14
+4.1V  (via drill 0.25 pad 0.51)
  Top 0.152: 50.62,3.84 v50.83,3.73 50.85,3.73 51.26,3.33 51.26,2.64 R9.1 | v48.16,9.86 45.85,9.86 C7.1 | 36.3,10.8 36.4,10.87 36.45,10.92 37.14,10.92 37.19,10.9 37.77,10.31 38.3,10.31 v38.41,10.16
  Top 0.254: U5.22 U5.21 39.7,15.11 39.7,15.7 39.9,15.9 41.02,15.9 41.2,15.72 v41.2,15.7 | 31.88,11.2 32.11,11.07 32.39,10.8 C23.1 35.71,10.8 36.3,10.8 | v38.41,10.16 38.41,10.26 39.12,10.26 39.22,10.36 39.22,10.9 U5.9 U5.10 39.7,10.9 39.7,10.39 39.73,10.36 40.18,10.36 40.21,10.39 U5.11 | J6.P$1 45.21,15.06 44.3,14.15 44.3,13.46 C21.1
  Top 0.406: C2.1 28.16,13.3 28.39,13.27 v29.26,12.55 29.65,12.14
  Top 0.508: S1.P3 25.39,12.52 27.63,12.52 28.39,13.27 | 29.65,12.14 U1.3 30.01,11.22 30.35,10.87 31.55,10.87 31.88,11.2 31.88,12.11 U1.1 | C22.1 53.87,14.89 J7.P$1
  Route15 0.152: v50.83,3.73 49.48,5.08 49.07,5.08 49.02,5.13 49.02,8.31 48.16,9.17 v48.16,9.86
  Route15 0.254: v38.41,10.16 38.41,12.9 v41.2,15.7
  Route15 0.508: v41.2,15.7 41.48,15.42 41.61,15.42 41.63,15.39 J6.P$1 | J6.P$1 | J6.P$1 45.31,15.14 45.31,12.7 v48.16,9.86 48.39,9.98 49.23,9.98 50.14,10.9 50.37,11.02 50.37,11.79 51.66,13.08 51.79,13.31 51.84,13.31 53.26,14.73 53.26,15.14 J7.P$1 53.34,15.39
  Bottom 0.152: J4.P3 43.13,9.5 43.21,9.58 43.61,9.58 43.69,9.5 J3.P3 47.42,9.5 48.03,9.5 | 48.03,9.5 48.06,9.47 48.06,9.04 48.03,9.02 47.37,9.02 J3.P4 | v48.16,9.86 48.16,9.63 48.03,9.5
  Bottom 0.406: v29.26,12.55 29.31,12.6 29.18,12.73 29.18,12.75 28.47,13.44 27.74,13.44 C24.1
  Bottom 0.508: D4.1 44.57,14.74 J6.P$1 | D1.1 53.75,14.85 J7.P$1
  pour Route15: 37.49,16.15 55.91,16.15 55.91,15.19 55.91,11.58 55.58,11.58 37.69,11.58 37.69,12.47
/CS_MEM  (via drill 0.25 pad 0.51)
  Top 0.203: v38.02,0.81 39.57,0.81 U3.4 | v24.08,2.13 22.66,2.13 22.66,2.01 U4.32
  Bottom 0.152: 27.13,0.58 27.05,0.64 26.47,1.22 25.81,1.22 25.15,0.56 24.61,0.56 24.08,1.09 v24.08,2.13
  Bottom 0.203: v38.02,0.81 37.8,0.58 27.13,0.58
/CS_RADIO  (via drill 0.25 pad 0.51)
  Top 0.152: v29.49,2.77 30.4,2.77 31.17,2.01 31.22,2.03 38.05,2.03 38.1,2.08 38.1,2.59 38.25,2.74 38.3,2.77 40.95,2.77 41.4,3.23 41.99,3.23 42.04,3.28 v42.09,3.28 | v49.51,1.52 49.51,2.26 50.01,2.77 50.01,4.12 49.61,4.52 49.51,4.52 49.48,4.55 49.48,7.52 v50.04,8.08
  Top 0.203: 23.39,4.24 U4.36 23.29,4.24 v21.21,4.24 21.16,4.24
  Bottom 0.152: 26.95,4.42 27.03,4.39 28.24,4.39 29.08,3.56 29.08,2.82 29.13,2.77 v29.49,2.77 | 49.53,1.52 49.53,1.75 48.01,3.28 v42.09,3.28 | 49.53,1.52 49.53,1.47 | 49.53,1.52 v49.51,1.52 | J3.P6 47.45,8 50.01,8 50.04,8.05 v50.04,8.08
  Bottom 0.203: J3.P6 | 26.95,4.42 22.28,4.42 22.1,4.24 v21.21,4.24
/RADIO_RST  (via drill 0.25 pad 0.51)
  Top 0.152: v48.67,0.76 48.69,0.74 | v22.66,2.82 22.4,2.82 22.35,2.77 22.2,2.77 22.15,2.72 U4.31
  Bottom 0.152: v22.66,2.82 23.06,3.23 26.69,3.23 27.76,2.16 37.8,2.16 38.71,1.25 42.55,1.25 43.23,0.56 48.46,0.56 v48.67,0.76 48.72,0.81 49.48,0.81 49.99,1.32 49.99,1.73 47.88,3.84 47.88,6.02 47.45,6.02 J3.P10
  Bottom 0.203: J3.P10 47.37,6.02
A0  (via drill 0.25 pad 0.51)
  Top 0.152: C20.1 13.43,14.44 13.46,14.38 13.46,14.12 14,13.59 14.94,13.59 15.32,13.21 15.32,12.27 15.65,11.94 U4.63 | 17.93,9.96 18.01,9.98 18.34,9.98 20.62,7.7 20.68,7.75 v21.23,7.75
  Top 0.203: 17.93,9.96 17.58,9.6 16.89,9.6 16.2,10.29 15.67,10.29 15.65,10.31 15.65,10.95 U4.63
  Top 0.254: R9.2 R8.2 54.25,1.11 J1.1
  Route15 0.152: v21.23,7.75 21.67,7.32 21.97,7.32 22.3,6.98 22.3,6.3 22.5,6.1 22.5,5.51 23.75,4.27 26.75,4.27 27.13,4.65 29.16,4.65 30.58,3.23 33.27,3.23 33.63,2.87 34.57,2.87 35.66,3.96 38.73,3.96 38.91,3.79 40.06,3.79 40.74,4.47 41.2,4.47 41.27,4.55 44.02,4.55 44.48,5.13 45.14,5.13 46.41,2.06 54.28,2.06 J1.1
A1  (via drill 0.25 pad 0.51)
  Top 0.203: v15.14,10.26 U4.64
  Bottom 0.152: 17.63,10.62 19.96,12.95
  Bottom 0.203: 19.96,12.95 24.61,12.95 24.64,12.93 J5.P9 | 17.63,10.62 15.49,10.62 v15.14,10.26
A2  (via drill 0.25 pad 0.51)
  Top 0.203: v14.58,10.82 14.58,10.26 U4.1
  Bottom 0.152: 18.82,12.32 17.93,12.32 17.65,12.04 17.65,11.15
  Bottom 0.203: 18.82,12.32 19.81,13.31 24.79,13.31 25.15,12.95 J5.P10 | 17.65,11.15 17.47,10.97 15.34,10.97 15.19,10.82 v14.58,10.82
AGND  (via drill 0.25 pad 0.51)
  Top 0.152: v29.11,11.71 29.11,10.8 28.73,10.8 C1.2 | U1.2 | 29.03,15.26 29.06,15.24 | v29.69,13.18 29.64,13.23 | v28.14,7.98 28.24,8.03 v30,6.69
  Top 0.203: v30,6.69 30.07,7.1 | v48.34,13.61 48.34,13.23 | 49.06,13.49 v49,13.61 | 49.71,13.49 v49.71,13.61
  Top 0.254: C1.2 26.96,10.8 J10.2 | C22.2 52.5,12.92 52.5,12.08 R5.1 | 37.14,11.76 37.44,11.76 U5.6 | 37.14,11.76 37.14,11.46 37.44,11.15 v37.62,11.15 | v36.6,14.28 36.7,14.3 36.75,14.25 37.44,14.25 U5.1 | 37.14,11.76 36.75,11.76 36.32,12.19 36.32,12.68 36.3,12.7 35.61,12.7 C23.2 | C21.2 46.18,13 46.18,12.8 45.9,12.52 45.75,12.52 45.72,12.5 45.72,11.81 R6.1
  Top 0.406: C2.2 29.03,15.26 29.13,15.09 29.31,14.91 29.31,13.97 29.59,13.69 29.59,13.36 v29.69,13.18 30.43,13.18 30.61,13.16 30.68,13.16 30.96,12.88 30.96,12.22 U1.2 | C5.2 29.95,7.32 v30,6.69
  Top 0.508: 49.06,13.23 U6.P$2 | 49.06,13.23 49.06,13.49 | 49.06,13.49 U6.P$5 | C22.2 52.03,13.49 49.71,13.49 49.06,13.49 | 49.06,13.23 48.34,13.23 46.18,13.23 46.18,13.44 C21.2
  Route2 0.152: v29.11,11.71 29.11,11.89 28.6,12.39 28.6,12.73 29.01,13.13 29.21,13.16 v29.69,13.18 29.72,13.16 29.72,13.13 32.13,13.13 32.66,13.66 32.66,14.94 J9.2 32.68,14.85 33.25,14.28 36.37,14.28 36.4,14.3 v36.6,14.28
  Route2 0.203: v30,6.69 29.51,6.77 29.03,7.25 29.03,11.09 29.11,11.16 v29.11,11.71
  Route2 0.254: v37.62,11.15 37.62,13.31 v36.6,14.28
  Route2 0.508: v48.34,13.61 46.53,13.61 43.76,10.85 37.95,10.85 37.72,11.07 v37.62,11.15
  Bottom 0.203: U2.2 29.95,6.98 v30,6.69
  Bottom 0.254: J9.2 32.35,14.63 C4.2 33.7,12.63 R3.2
  pour Route2: 19.35,16.21 55.83,16.21 55.88,11.76 32.44,11.4 32.44,4.83 28.09,4.83 28.09,7.52 24.26,7.52 24.26,13.11 19.25,13.03 19.33,13.26
  pour Bottom: 19.38,16.03 55.58,16.03 55.58,11.66 32.44,11.66 32.49,5.74 28.5,5.74 28.45,7.7 28.45,8.1 24.49,8.1 24.49,13.28 19.56,13.28 19.56,14.99
CLKI
  Top 0.254: R10.2 24.47,2.74 U4.33
DISTANCE_OE  (via drill 0.25 pad 0.51)
  Top 0.152: U4.6 15.09,7.75 15.14,7.7 17.6,7.7 17.65,7.64 17.65,6.91 20.24,4.32 20.34,4.32 20.73,4.7 v20.73,4.75 | v44.78,2.79 44.48,2.79 44.27,3 44.27,3.18 44.17,3.28 44.17,4.04 43.97,4.24 43.97,4.93 45.03,5.99 45.82,5.99 45.87,6.02 45.95,6.1 45.95,7.8 45.54,8.2 45.29,8.2 44.98,8.51 43.97,8.51 v43.89,8.59
  Route15 0.152: v20.73,4.75 21.21,5.23 21.92,5.23 23.49,3.66 27,3.66 27.38,4.04 28.9,4.04 30.48,2.46 32.61,2.46 32.82,2.26 34.82,2.26 35.13,2.57 40.06,2.57 40.23,2.74 44.73,2.74 v44.78,2.79 44.81,2.82
  Bottom 0.152: J4.P5 43.33,8.51 43.41,8.59 v43.89,8.59
GND  (via drill 0.25 pad 0.46, 0.25 pad 0.51)
  Top 0.152: U4.10 12.2,5.75 11.96,5.51 11.96,4.94 R11.1 | v18.15,11.84 U4.58 | v18.15,11.84 | v19.66,11.84 19.66,11.01 U4.55 | C20.2 12.12,15.19 v12.12,14.07 12.12,13.08 12.47,13.08 C8.1 | C17.2 15.53,13.42 14.73,14.22 14.35,14.22 v14.2,14.07 | U4.35 23.89,3.75 24.05,3.91 24.05,4.72 24.15,4.83 24.8,4.83 C18.2 24.9,4.93 D5.C 24.21,6.12 24.18,6.15 24.26,8.74 v24.15,7.47 24.14,8.75 U4.45 | B1.5 B1.2 | 30.33,5.18 S2.1 30.25,5.18 29.64,5.18 27.36,7.47 v27.36,8 | v48.36,4.57 48.36,3.48 C3.2 | J2.6 50.95,8.89 50.95,6.4 50.88,6.32 50.24,6.32 C6.2 | v50.44,1.09 51.21,1.09 51.23,1.07 51.26,1.09 R8.1 | v43.48,11.51 43.97,11.02 43.97,10.31 C7.2
  Top 0.203: C19.2 18.97,1.02 | v19.76,1.14 20.59,1.02 R1.1 | 15.04,5.74 14.45,5.74 U4.10 | 15.04,5.74 15.65,6.35 15.65,6.98 15.37,7.26 U4.7 | v17.35,10.11 16.89,10.11 16.64,10.36 U4.61 | v13.87,10.77 13.79,10.69 13.79,10.24 13.77,10.21 13.28,10.21 B1.5 | C12.2 14.63,12.12 14.61,12.09 v13.72,12.09 | 15.04,5.74 v15.23,5.26 | v27.1,2.13 27.05,2.18 R10.1 | v42.75,12.83 42.55,12.83 42.11,13.26 41.58,13.26 U5.16
  Top 0.254: C19.2 18.65,1.18 U4.24 18.64,2.11 v18.64,2.74 | U5.EP 39.7,13.25 U5.16 | U3.7 48.43,3.36 C3.2 | v15.19,3.2 16.26,3.02 16.64,2.64 U4.20
  Route2 0.152: v19.66,11.84 v18.15,11.84 17.42,11.84 16.43,11.84 14.67,13.6 v14.2,14.07 v12.12,14.07 | v27.36,8 27.46,6.45 26.61,5.07 | v50.44,1.09 50.44,2.67 50.16,2.95 50.16,3.25 49.3,4.12 49.2,4.12 49.15,4.17 48.46,4.17 48.36,4.27 v48.36,4.57 48.36,5.36 48.36,6.76 48.77,7.16 48.77,8.03 49.51,8.76 49.91,9.2 50.88,10.16 52.17,10.16 J2.6 | v43.48,11.51 43.48,12.09 v42.75,12.83
  Route2 0.203: 19.76,1.63 v19.76,1.14 | 19.76,1.63 v18.64,2.74 17.93,2.74 17.92,2.76 16.56,2.76 16.29,3.02 v15.19,3.2 15.19,4.46 v15.23,5.26 15.3,5.26 15.93,5.88 15.93,8.29 13.87,10.35 v13.87,10.77 13.72,10.92 v13.72,12.09 13.72,12.65 14.67,13.6 | 17.42,11.84 17.42,10.11 | 17.42,10.11 17.42,9.93 | 17.42,10.11 v17.35,10.11 | v27.1,2.13 26.59,1.63 19.76,1.63
  Route2 0.254: v27.1,2.13 27.1,4.57 26.61,5.07 24.15,7.52 v24.15,7.47 | 45.24,5.36 45.24,7.87 45.16,7.98 45.16,8.1 42.95,10.31 41.43,10.31 41.39,10.27 | 41.39,10.27 41.25,10.14 | 41.39,10.27 v41.48,10.18
  Route2 0.508: 48.36,5.36 45.24,5.36 41.55,5.36 41.12,5.79 39.47,5.79 39.24,5.92 38.94,5.92 38.43,6.43 36.86,6.43 36.63,6.35 35.64,5.36 33.38,5.36 33.22,4.57 30.02,4.37 27.33,4.72 27.46,6.45
  Bottom 0.152: C13.2 arc90 C13.2 | v50.44,1.09 50.29,1.25 | 46.69,10.03 46.69,10.49 46.71,10.52 47.37,10.52 J3.P1 | 46.69,10.03 46.71,10.01 J3.P2 | 46.69,10.03 46.63,10.01 42.67,10.01 J4.P2 41.96,10.01 41.94,10.03 41.94,10.18 41.94,10.49 41.96,10.52 42.62,10.52 J4.P1 42.67,10.52 43.28,10.52 43.48,10.72 v43.48,11.51
  Bottom 0.203: 13.84,10.67 13.84,10.74 v13.87,10.77 | v13.72,12.09 13.85,12.23 C11.2 15.49,12.22 17.32,12.22 17.78,12.68 18.29,12.68 18.41,12.8 18.41,13.49 C14.2 | 16.99,1.07 18.02,1.07 18.64,1.69 v18.64,2.74
  Bottom 0.254: C16.2 15.23,2.28 C15.2 15.19,2.44 15.19,3 15.21,3.02 v15.19,3.2 | 16.99,1.07 C13.2 | v41.48,10.18 41.94,10.18
  other vias: 10.46,9.96 10.56,7.75 10.56,6.86 12.92,14.17 13.62,13.07 13.12,5.77 11.92,5.87
  pour Route2: 11.2,16.48 11.2,10.46 10.27,10.46 10.27,5.96 11.37,5.96 11.2,0.15 56.11,0.15 56.11,11.15 52.65,11.15 52.65,10.59 33.07,10.59 33.07,4.37 27.58,4.37 27.58,7.04 23.72,7.04 23.72,12.12 23.67,12.12 23.67,12.57 18.26,12.27 18.21,12.8 18.34,16.31
  pour Route15: 11.38,16.36 11.3,16.36 11.3,0.25 14.17,0.25 14.17,0.38 14.17,16.15 14,16.15
  pour Top: 14.27,15.96 11.67,15.96 11.67,13.25 11.67,10.25 10.27,10.25 10.27,6.25 10.37,6.25 11.56,6.25 11.56,4.16 14.67,4.16 14.67,15.86
  pour Bottom: 11.84,16.21 11.53,16.31 11.53,10.26 10.46,10.26 10.46,6.4 11.61,6.4 11.61,0.56 55.6,0.56 55.6,10.36 33.3,10.36 33.3,4.57 27.51,4.57 27.51,6.83 23.6,6.83 23.6,11.96 17.91,11.96 17.91,15.75 12.45,15.85 12.19,16.08
INT  (via drill 0.25 pad 0.51)
  Top 0.152: U4.3 15.09,9.25 16.33,8 17.73,8 17.96,7.77 17.96,7.04 18.16,6.83 20.27,6.83 20.32,6.78 v20.45,6.78 | v44.83,3.91 44.65,3.99 44.27,4.37 44.27,4.8 45.16,5.69 46.15,5.69 46.25,5.79 46.25,7.93 45.67,8.51 45.41,8.51 44.86,9.07 43.69,9.07 43.64,9.02 43.51,9.02 43.46,9.04 v43.41,9.09
  Route15 0.152: v20.45,6.78 20.93,6.3 21.87,6.3 22.2,5.97 22.2,5.39 23.62,3.96 26.87,3.96 27.25,4.34 29.03,4.34 30.61,2.77 32.74,2.77 32.94,2.57 34.7,2.57 35,2.87 38.23,2.87 38.89,3.48 40.18,3.48 40.23,3.53 40.56,3.53 40.62,3.5 41.2,3.5 41.5,3.81 41.71,3.81 42.14,4.24 42.32,4.24 42.34,4.22 42.39,4.24 43.66,4.24 43.71,4.19 43.76,4.24 43.89,4.24 v44.83,3.91
  Bottom 0.152: 42.62,9.02 J4.P4 42.67,9.02 43.33,9.02 v43.41,9.09
LED1  (via drill 0.25 pad 0.51)
  Top 0.203: v27.63,3.56 R7.2 | v22.66,3.56 22.2,3.1 22.05,3.1 21.64,2.69 U4.30
  Bottom 0.203: v22.66,3.56 v27.63,3.56
MISO  (via drill 0.25 pad 0.51)
  Top 0.152: v37.03,3.48 37.52,3.96 40.87,3.96 40.92,3.99 v41,3.99 | U3.8 46.3,4.62 | U3.8 46.23,4.62 45.01,4.62 44.96,4.6 v44.76,4.6 | 46.05,8.71 v46.15,8.71 46,8.66 45.97,8.64 46.61,8 | 46.61,8 46.61,5.59 46.76,5.44 46.76,4.62 46.38,4.62 U3.8 | J2.1 53.49,6.3 53.49,8.76 53.37,8.89 53.37,10.64 52.71,11.3 51.69,11.3 51.66,11.28 50.37,11.28 50.32,11.23 50.22,11.23 47.04,8.05 46.66,8.05 46.61,8
  Top 0.203: 21.65,5.7 21.74,5.61 22.58,5.61 22.71,5.74 23.39,5.74 U4.39 | 21.65,5.7 21.61,5.74 | v21.72,5.77 21.65,5.7
  Bottom 0.152: v37.03,3.48 37.03,3.23 36.88,3.07 30.86,3.07 28.27,5.66 21.79,5.66 v21.72,5.77 | 44.86,4.6 v44.76,4.6 44.22,4.17 41.33,4.14 | 41.33,4.14 40.87,3.96 | v41,3.99 41.33,4.14 | J3.P7 47.37,7.52 46.66,7.52 46.58,7.59 46.58,8.31 46.53,8.33 v46.15,8.71
  Bottom 0.203: v21.72,5.77 21.72,5.69
MOSI  (via drill 0.25 pad 0.51)
  Top 0.152: U3.1 39.57,4.62 v37.95,4.62 38.02,4.67
  Top 0.203: v19.99,5.26 U4.38
  Bottom 0.152: v19.99,5.26 21.89,5.26 22,5.36 28.14,5.36 30.73,2.77 37.01,2.77 37.54,3.3 37.54,3.56 v37.95,4.62 38.15,4.83 40.36,4.83 40.41,4.85 42.06,4.85 42.11,4.9 43.31,4.9 45.41,7.01 J3.P8 47.42,7.01 48.08,7.01 48.67,7.59 J2.4
MOTOR3_DIRECTION  (via drill 0.25 pad 0.51)
  Top 0.152: v42.32,14.35 41.48,14.25 U5.18 | v34.39,10.26 34.21,10.44 31.8,10.44 31.75,10.39 31.55,10.39 31.52,10.36 31.39,10.36 31.37,10.39 30.53,10.39 30.5,10.36 30.4,10.36 30.38,10.39 30.15,10.39 30.1,10.44 29.46,10.44 29.34,10.31 29.34,10.18 29.31,10.16 27.91,10.16 27.69,9.93 27.69,9.83 27.66,9.8 26.8,9.8 26.64,9.96 v26.36,9.96 | v18.69,8.31 16.46,8.31 15.11,9.65 15.11,9.73 15.09,9.75 U4.2
  Bottom 0.152: v42.32,14.35 38.38,14.25 v34.39,10.26 | v26.36,9.96 25.88,9.47 24.76,9.47 23.6,8.31 v18.69,8.31
N$1
  Top 0.254: D2.C 23.29,0.91 21.95,0.91 21.95,0.94 R1.2
N$2
  Top 0.254: C1.1 29.97,9.5 U1.4
N$3
  Bottom 0.254: R2.1 32.13,6.31 D3.A
N$5
  Bottom 0.508: 27.41,8.03 28.09,8.03 28.09,7.98
N$66
  Top 0.152: C9.1 12.23,8.92 B1.3
N$67
  Top 0.508: U6.P$4 50.59,15.4 J7.P$2
  Bottom 0.508: J7.P$2 51.45,14.96 D1.2
N$68
  Top 0.152: C10.1 13.23,8.35 B1.4
N$69
  Top 0.254: J6.P$2 47.89,15.39 U6.P$6
  Bottom 0.508: D4.2 46.87,15.26 J6.P$2
N$70
  Top 0.152: B1.1 12.48,11.1 C8.2
  Top 0.203: Y1.FEED 10.02,8.25 arc90 10.43,8.66 arc-112 11.1,9.12 arc90 11.57,9.59 11.73,10.57 arc-90 12.03,10.87 B1.1
N$71
  Top 0.152: C10.2 13.28,6.48 13.51,6.25 U4.9
N$72  (via drill 0.25 pad 0.51)
  Top 0.152: v15.14,6.76 U4.8 | v12.47,6.4 12.47,6.86 12.32,7.01 C9.2
  Bottom 0.152: v15.14,6.76 12.83,6.76 v12.47,6.4
N$75
  Top 0.152: C12.1 16.98,12.13 17.14,11.96 U4.60
N$76
  Top 0.152: Q1_16MHZ.1 16.32,14.15 17.78,14.15 18.01,13.92 18.01,12.88 18.65,12.24 U4.57
  Bottom 0.152: C11.1 15.38,15.09 Q1_16MHZ.1
N$77
  Top 0.152: U4.56 19.15,12.81 19.02,12.93 18.44,12.93 18.34,13.03 18.34,14.13 Q1_16MHZ.2
  Bottom 0.152: C14.1 17.13,14.88 Q1_16MHZ.2
N$78
  Top 0.152: U4.17 13.53,2 Q2_32.768KHZ.1
  Bottom 0.254: C15.1 13.22,2.31 Q2_32.768KHZ.1
N$79
  Top 0.152: U4.18 15.65,1.27 15.42,1.04 12.49,1.04 Q2_32.768KHZ.2
  Bottom 0.254: C16.1 12.47,1.06 Q2_32.768KHZ.2
N$98  (via drill 0.25 pad 0.38)
  Top 0.254: v16.79,3.81 17.15,3.45 U4.21 U4.22
  Bottom 0.254: v16.79,3.81 16.79,3.01 C13.1
N$99
  Top 0.152: R7.1 26.06,4.87 D5.A
N$114
  Top 0.254: U5.23 U5.24 37.8,15.42 J8.P$1
N$115
  Top 0.203: 37.45,13.77 36.02,13.77
  Top 0.254: U5.3 U5.2 37.45,13.77 | J8.P$2 34.88,14.95 35.69,14.15 36.02,13.77
N$120
  Top 0.203: 40.73,14.99 U5.19 40.82,14.93 42.22,14.93 42.24,14.96 R4.1
OC1A  (via drill 0.25 pad 0.51)
  Top 0.152: 37.57,5.36 v37.62,5.31 37.52,5.49 37.52,8.25 v37.74,9.68 | v49,11.33 49.71,11.33 50.01,11.63 50.01,12.14 U6.P$3
  Top 0.203: U4.41 22.71,6.76 22.58,6.63 21.92,6.63 21.89,6.66 21.87,6.73 v21.82,6.78
  Top 0.254: U6.P$3 50.66,12.12 R5.2
  Bottom 0.152: v21.82,6.78 21.87,6.55 22.05,6.55 22.33,6.27 28.52,6.27 31.11,3.68 35.38,3.68 35.59,3.89 35.84,3.89 35.89,3.84 36.09,3.84 36.68,4.42 36.68,4.7 37.24,5.26 37.57,5.26 v37.62,5.31 | v37.74,9.68 37.52,9.96 39.85,12.29 45.49,12.29 46.46,11.33 47.42,11.33 47.9,10.85 48.31,10.85 48.79,11.33 v49,11.33
  Bottom 0.203: v21.82,6.78 21.82,6.63
OC1B  (via drill 0.25 pad 0.51)
  Top 0.152: 37.01,5.79 v36.96,5.74 37.19,5.84 37.19,9.58 36.96,10.24 v36.96,10.34 | v48.11,11.33 48.11,12.01 U6.P$1
  Top 0.203: 21.01,7.04 v21.13,7.04 21.34,7.04 21.59,7.29 22.68,7.29 22.71,7.26 U4.42
  Top 0.508: R6.2 47.95,12.22 U6.P$1
  Bottom 0.152: v21.13,7.04 21.23,7.09 21.41,7.26 22.02,7.26 22.3,6.98 22.3,6.73 22.45,6.58 28.65,6.58 31.24,3.99 35.26,3.99 35.46,4.19 36.02,4.19 36.37,4.55 36.37,4.83 36.7,5.16 | 36.7,5.16 36.7,5.23 | 36.7,5.16 37.01,5.46 37.01,5.51 36.96,5.56 v36.96,5.74 | 47.88,11.63 47.9,11.66 | 47.88,11.63 46.58,11.63 45.62,12.6 43.66,12.6 42.95,13.31 40.44,13.31 38.76,11.63 37.41,11.63 37.03,11.25 v36.96,10.34 | v48.11,11.33 48.11,11.41 47.88,11.63
  Bottom 0.203: v21.13,7.04 21.16,7.04
OC2A  (via drill 0.25 pad 0.51)
  Top 0.152: 37.14,4.52 v37.16,4.5 36.47,5.18 36.47,5.94 36.6,6.07 36.6,7.09 36.88,7.37 36.88,9.2 36.47,9.6 v36.47,9.7 | v42.75,13.79 42.22,13.79 42.16,13.74 41.48,13.74 U5.17
  Top 0.203: 21.11,6.17 v20.01,6.22 21.39,6.17 21.49,6.27 22.68,6.27 22.71,6.25 U4.40
  Bottom 0.152: v20.01,6.22 21.21,6.25 21.92,6.25 22.2,5.97 28.4,5.97 30.99,3.38 36.07,3.38 37.16,4.47 v37.16,4.5 | v36.47,9.7 36.47,11.91 38.51,13.95 39.68,13.95 40.01,13.61 42.39,13.61 42.62,13.84 42.67,13.79 v42.75,13.79
PCINT7  (via drill 0.25 pad 0.51)
  Top 0.203: 21.83,7.86 22,7.64 22.61,7.64 22.71,7.75 U4.43 | 21.83,7.86 21.84,7.87 | v21.92,7.8 21.83,7.86
  Bottom 0.152: v21.92,7.8 22.83,6.88 28.78,6.88 31.37,4.29 35.13,4.29 35.33,4.5 35.89,4.5 36.07,4.67 36.07,4.95 36.4,5.28 36.4,5.87 36.75,6.22 37.39,6.22 38.41,5.21 43.18,5.21 45.01,7.04 45.01,8.25 45.95,9.2 46.36,9.2 46.63,8.91 46.63,8.69 46.76,8.56 46.81,8.56 46.84,8.53 46.84,8.51 J3.P5
PE0  (via drill 0.25 pad 0.51)
  Top 0.152: v24.13,9.53 24.13,9.27 24.1,9.25 23.42,9.25 U4.46
  Bottom 0.152: v24.13,9.53 24.1,9.55 24.1,10.59 24.15,10.64 J5.P8
PE1  (via drill 0.25 pad 0.51)
  Top 0.152: U4.47 22.81,9.75 22.69,9.64 22.69,9.43 v22.66,9.58
  Bottom 0.152: J5.P7 23.64,11.74 23.82,11.56 23.82,10.74 22.69,9.61 v22.66,9.58
PE2  (via drill 0.25 pad 0.51)
  Top 0.152: U4.48 23.41,10.26 v23.3,11.06
  Bottom 0.152: v23.3,11.06 23.14,11.32 J5.P6
PE3  (via drill 0.25 pad 0.51)
  Top 0.152: U4.49 22.64,10.25 v22.64,10.28
  Bottom 0.152: v22.64,10.28 J5.P5
PE4  (via drill 0.25 pad 0.51)
  Top 0.152: U4.50 22.15,9.73 v21.93,9.57
  Bottom 0.152: v21.93,9.57 22.15,9.73 22.15,10.38 22.14,10.39 J5.P4
PE5  (via drill 0.25 pad 0.51)
  Top 0.152: U4.51 21.65,10.36 v21.65,10.25
  Bottom 0.152: v21.65,10.25 J5.P3
PE6  (via drill 0.25 pad 0.51)
  Top 0.152: 21.16,9.55 v21.16,9.7 21.16,11 U4.52
  Bottom 0.152: v21.16,9.7 21.13,9.7 21.13,12.29 J5.P2
PE7  (via drill 0.25 pad 0.51)
  Top 0.152: U4.53 v20.65,10.26
  Bottom 0.152: v20.65,10.26 J5.P1
PROG1
  Bottom 0.508: U2.5 32.79,10.41 R3.1
RESET  (via drill 0.25 pad 0.51)
  Top 0.152: S2.3 30.33,1.37 28.37,1.37 R12.1 | v36.75,1.37 36.8,1.42 40.87,1.42 41.02,1.57 41.07,1.6 41.33,1.6 41.68,1.96 41.73,1.98 42.65,2.9 42.65,3.4 42.44,3.61 42.44,4.47 42.37,4.55 42.37,5.03 41.89,5.51 41.89,5.97 v41.83,6.02 41.78,6.02
  Top 0.203: v31.55,1.37 30.4,1.37 S2.3 | v16.41,4.42 15.42,4.42 15.09,4.75 U4.12
  Route15 0.152: v48.16,8.48 47.9,8.23 44.58,8.23 43.05,6.71 42.62,6.22 v41.83,6.02
  Bottom 0.152: v16.41,4.42 17.8,4.42 18.59,3.63 18.59,3.38 18.62,3.33 18.74,3.33 19.13,2.95 19.13,2.87 19.96,2.03 22.99,2.03 23.57,2.62 25.5,2.62 26.77,1.35 27.43,1.35 27.63,1.55 31.44,1.55 31.52,1.47 v31.55,1.37 31.55,1.55 36.58,1.55 v36.75,1.37 | v41.83,6.02 42.55,6.02 J4.P10 | v48.16,8.48 48.34,8.31 49.58,8.31 50.24,8.97 53.57,8.97 J2.5
  Bottom 0.203: J4.P10 42.62,6.02 | v31.55,1.37 31.47,1.32
RXI  (via drill 0.25 pad 0.51)
  Top 0.152: 44.65,7.42 v44.53,7.42 44.68,7.37 44.68,6.93 43.05,5.31 43.05,5.13 42.98,5.05 42.98,4.8 43.05,4.72 43.05,3.86 43.26,3.66 43.26,2.9 43.36,2.79 43.36,2.62 43.46,2.31 43.46,2.03 v43.31,2.03
  Top 0.203: 20.7,3.43 20.7,3.25 20.14,2.69 U4.27 | 20.7,3.43 20.7,3.45 | 20.7,3.43 v20.78,3.43
  Route15 0.152: v20.78,3.43 21.87,2.34 22.86,2.34 23.14,2.62 24.28,2.62 24.94,1.96 25.91,1.96 26.29,1.57 27.63,1.57 27.91,1.85 32.36,1.85 33.07,1.14 34.14,1.14 34.42,0.86 36.17,0.86 36.22,0.91 36.27,0.86 36.98,0.86 37.24,1.12 37.24,1.19 37.34,1.3 37.39,1.3 37.69,1.6 38.35,1.6 39.09,0.86 41.22,0.86 42.01,1.65 42.93,1.65 v43.31,2.03
  Bottom 0.152: 44.53,7.49 43.69,7.49 43.36,7.16 43.36,7.04 43.33,7.01 J4.P8 | 44.53,7.49 44.55,7.49 | v44.53,7.42 44.53,7.49
SCK  (via drill 0.25 pad 0.51)
  Top 0.152: v38.02,3.35 39.57,3.35 U3.2 39.65,3.35
  Top 0.203: v21.72,4.75 22.17,4.6 22.55,4.6 22.71,4.75 U4.37
  Bottom 0.152: 21.95,4.67 22.02,4.72 22.35,5.05 28.02,5.05 30.61,2.46 37.14,2.46 v38.02,3.35 39.14,4.47 43.56,4.5 44.27,5.18 44.27,5.44 45.34,6.5 J3.P9 47.42,6.5 48.08,6.5 48.11,6.53 48.11,6.6 48.79,7.29 50.75,7.29 51.61,6.43 52.91,6.43 54.08,7.59 J2.3
  Bottom 0.203: v21.72,4.75 21.95,4.67
SCL  (via drill 0.25 pad 0.51)
  Top 0.152: v42.34,0.76 42.55,0.56 44.2,0.56 44.48,0.84 44.48,1.68 44.27,1.88 44.27,2.57 43.97,2.87 43.97,3.05 43.87,3.15 43.87,3.91 43.66,4.12 43.66,5.05 44.91,6.3 45.54,6.3 45.64,6.4 45.64,7.67 45.41,7.9 45.36,7.85 45.21,7.85 44.86,8.2 44.2,8.2 44.09,8.1 44.02,8.1 43.92,8 v43.41,8
  Top 0.203: 19.23,4.09 v19.23,4.01 19.23,2.77 19.15,2.69 U4.25
  Bottom 0.152: v42.34,0.76 42.14,0.56 38.96,0.56 37.67,1.85 27.51,1.85 27.3,1.65 26.9,1.65 25.63,2.92 23.37,2.92 23.32,2.87 23.32,2.79 22.86,2.34 20.09,2.34 19.43,3 19.43,3.07 19.23,3.28 v19.23,4.01 | J4.P6 42.67,8 v43.41,8
SDA  (via drill 0.25 pad 0.51)
  Top 0.152: 43.31,4.95 43.36,5 43.36,5.18 45.14,6.96 45.09,7.01 45.09,7.54 44.73,7.9 44.32,7.9 44.22,7.8 44.15,7.8 43.74,7.39 v41.83,7.39 | 43.31,4.95 43.28,4.93 | 43.31,4.95 43.36,4.9 43.36,3.99 43.56,3.79 43.56,3.02 43.66,2.92 43.66,2.74 43.97,2.44 43.97,1.75 44.17,1.55 44.17,1.07 v43.66,1.07
  Top 0.203: U4.26 19.66,2.01 19.66,2.72 19.86,2.92 19.86,3.18 v19.91,3.2
  Route15 0.152: v19.91,3.2 21.46,1.65 25.78,1.65 26.87,0.56 34.19,0.56 34.24,0.61 34.29,0.56 37.11,0.56 37.52,0.96 37.54,1.02 37.82,1.3 38.23,1.3 38.96,0.56 41.35,0.56 42.04,1.25 42.55,1.25 42.72,1.07 v43.66,1.07
  Bottom 0.152: 42.62,7.52 J4.P7 42.57,7.52 41.96,7.52 v41.83,7.39
  Bottom 0.203: v19.91,3.2 19.94,3.18
STAT1
  Bottom 0.254: U2.1 30.92,6.11 D3.C
TST
  Top 0.152: U4.11 13.57,5.25 R11.2
TXO  (via drill 0.25 pad 0.51)
  Top 0.152: 44.07,6.96 v43.99,6.96 44.12,6.91 44.12,6.81 42.75,5.44 42.75,5.26 42.67,5.18 42.67,4.67 42.75,4.6 42.75,3.73 42.95,3.53 42.95,2.77 43,2.72 43,2.46 42.95,2.41 42.9,2.41 v42.62,2.13
  Top 0.203: v21.97,3.61 21.97,3.53 21.16,2.72 20.68,2.72 20.65,2.69 U4.28
  Route15 0.152: v28.42,2.64 28.9,2.16 32.49,2.16 33.2,1.45 34.27,1.45 34.54,1.17 35.23,1.17 35.97,1.91 38.48,1.91 39.22,1.17 41.1,1.17 41.91,1.98 41.96,1.96 42.62,1.96 | 42.75,1.98 42.72,1.96 42.62,1.96 | 42.62,1.96 v42.62,2.13
  Bottom 0.152: 27.86,4.06 27.91,3.99 28.12,3.79 28.12,2.79 28.32,2.59 28.37,2.59 v28.42,2.64 | J4.P9 42.7,6.5 43.33,6.5 43.56,6.73 43.79,6.73 43.82,6.78 v43.99,6.96
  Bottom 0.203: 27.86,4.06 22.43,4.06 v21.97,3.61 | J4.P9
VBATT
  Top 0.254: S1.P2 23.77,12.91 24.07,12.61 24.07,11.79 24.31,11.54 24.31,11.45 J10.1
  Bottom 0.254: U2.3 28.2,8.83 28.19,8.84 28.19,11.89 27.71,12.22 26.24,12.22 J10.1
VIN
  Bottom 0.254: J9.1 30.55,14.83 C4.1 29.96,12.04 U2.4 28.99,9.41 29.23,9.17 31.76,9.17 R2.2

### Text on the board
bPlace: SensorFly uC v5